# Altium project Wacky Racer.PrjPcb
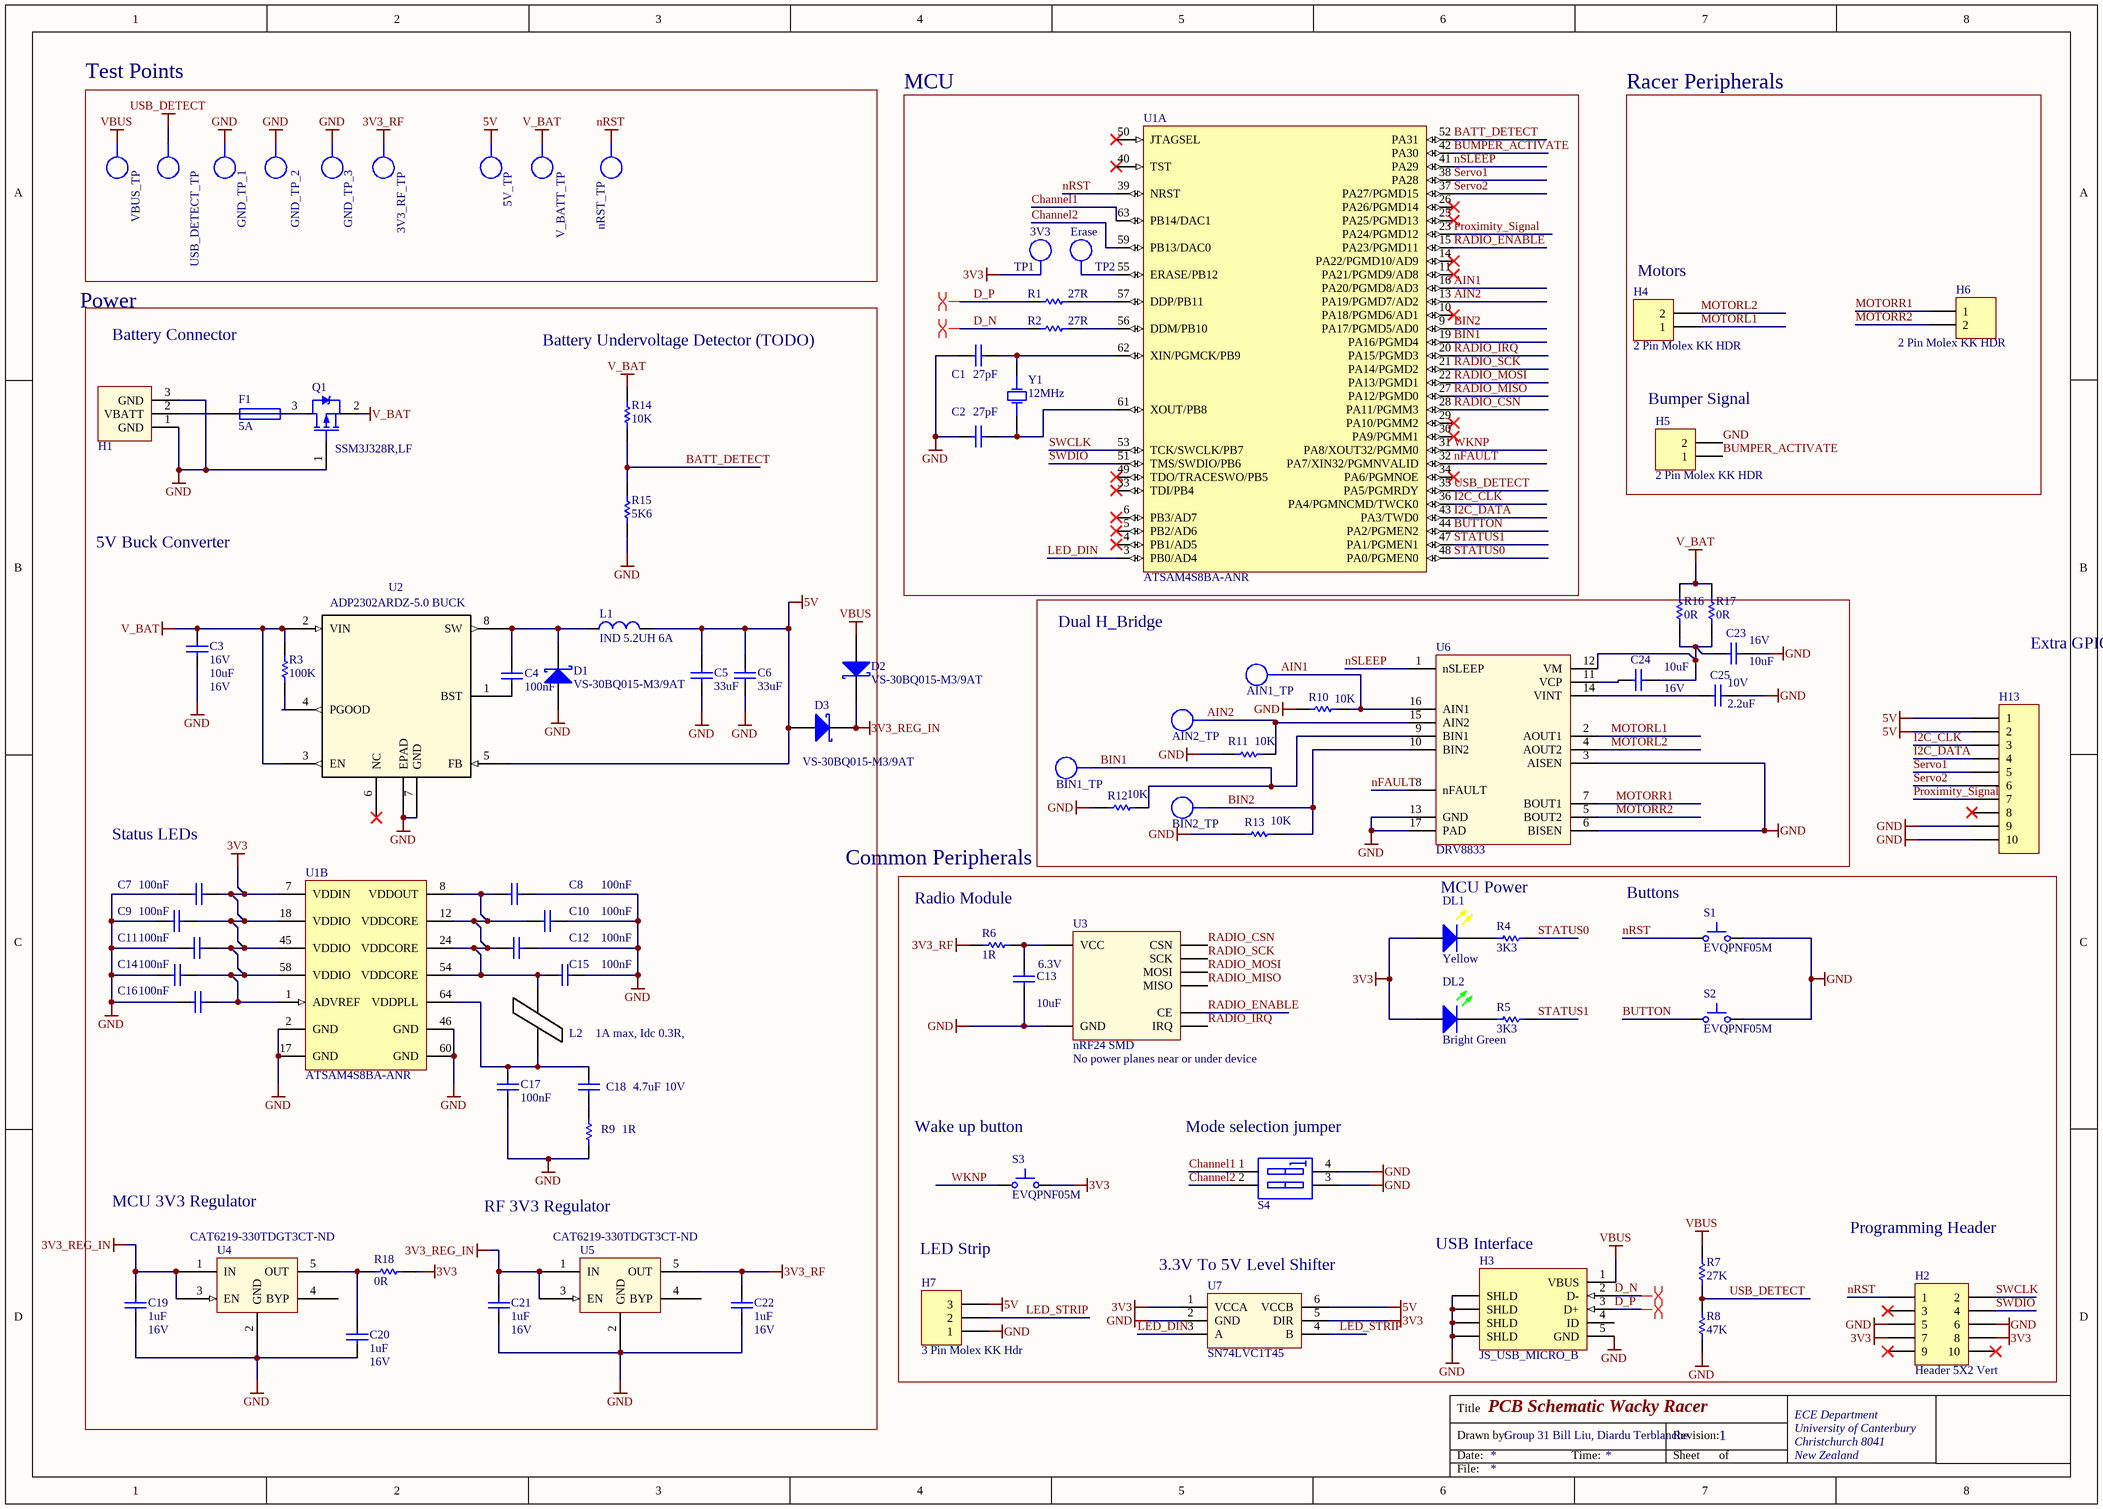
[diagram p0: Wacky Racer Schematic.schdoc]
1 sheet, 87 parts. Net scope: global (net labels, ports and power ports of the same name join across sheets).
Board files: Group31 B_L D_T.PcbDoc, Wacky_Racer_PCB.PcbDoc

## Sheet Wacky Racer Schematic.schdoc: PCB Schematic Wacky Racer
size A3; Author: Bill Liu, Diardu Terblanche; DrawnBy: Group 31 Bill Liu, Diardu Terblanche; Address1: ECE Department; Address2: University of Canterbury; Address3: Christchurch 8041; Address4: New Zealand; Revision: 1

### Parts
3V3_RF_TP  TP  [TP_1206]  (value not drawn)  (no BOM)
5V_TP  TP  [TP_1206]  (value not drawn)  (no BOM)
AIN1_TP  TP  [TP_1206]  (value not drawn)  (no BOM)
AIN2_TP  TP  [TP_1206]  (value not drawn)  (no BOM)
BIN1_TP  TP  [TP_1206]  (value not drawn)  (no BOM)
BIN2_TP  TP  [TP_1206]  (value not drawn)  (no BOM)
C1  27pF  [CAPC1608L]
C2  27pF  [CAPC1608L]
C3  Voltage - Rated: 16V  [CAPC2012L]  (hidden comment: 10uF)
C4  100nF  [CAPC1608L]
C5  33uF  [CAPC2012L]
C6  33uF  [CAPC2012L]
C7  100nF  [CAPC1608L]
C8  100nF  [CAPC1608L]
C9  100nF  [CAPC1608L]
C10  100nF  [CAPC1608L]
C11  100nF  [CAPC1608L]
C12  100nF  [CAPC1608L]
C13  Voltage - Rated: 6.3V  [CAPC1608L]  (hidden comment: 10uF)
C14  100nF  [CAPC1608L]
C15  100nF  [CAPC1608L]
C16  100nF  [CAPC1608L]
C17  100nF  [CAPC1608L]
C18  Max Voltage: 10V  [CAPC1608N]  (hidden comment: 4.7uF)
C19  Max Voltage: 16V  [CAPC1608L]  (hidden comment: 1uF)
C20  Max Voltage: 16V  [CAPC1608L]  (hidden comment: 1uF)
C21  Max Voltage: 16V  [CAPC1608L]  (hidden comment: 1uF)
C22  Max Voltage: 16V  [CAPC1608L]  (hidden comment: 1uF)
C23  Voltage - Rated: 16V  [CAPC2012L]  (hidden comment: 10uF)
C24  Voltage - Rated: 16V  [CAPC2012L]  (hidden comment: 10uF)
C25  Max Voltage: 10V  [CAPC1608L]  (hidden comment: 2.2uF)
D1  VS-30BQ015-M3/9AT  [SMC]
D2  VS-30BQ015-M3/9AT  [SMC]
D3  VS-30BQ015-M3/9AT  [SMC]
DL1  Yellow  [WL-SMCW0603]
DL2  Bright Green  [WL-SMCW0603]
F1  5A  [RESC3216N]
GND_TP_1  TP  [TP_1206]  (value not drawn)  (no BOM)
GND_TP_2  TP  [TP_1206]  (value not drawn)  (no BOM)
GND_TP_3  TP  [TP_1206]  (value not drawn)  (no BOM)
H1  Battery_HEADER_3pin  [BATT_HEADER_3POS]  (value not drawn)
H2  Header 5X2 Vert  [IDC2.54-V10D]
H3  JS_USB_MICRO_B  [FCI_USB_10118194-0001LF]
H4  2 Pin Molex KK HDR  [MOLEX_KK_2_HDR]
H5  2 Pin Molex KK HDR  [MOLEX_KK_2_HDR]
H6  2 Pin Molex KK HDR  [MOLEX_KK_2_HDR]
H7  3 Pin Molex KK Hdr  [MOLEX_KK_3_HDR]
H13  (no value)  [MOLEX_KK_10_HDR]
L1  IND 5.2UH 6A  [INDUCTOR5u2]
L2  1A max, Idc 0.3R,  [INDC3216L]
nRST_TP  TP  [TP_1206]  (value not drawn)  (no BOM)
Q1  SSM3J328R,LF  [SOT23_L]
R1  27R  [RESC1608L]
R2  27R  [RESC1608L]
R3  100K  [RESC1608L]
R4  3K3  [RESC1608L]
R5  3K3  [RESC1608L]
R6  1R  [RESC3216L]
R7  27K  [RESC1608L]
R8  47K  [RESC1608N]
R9  1R  [RESC3216L]
R10  10K  [RESC1608L]
R11  10K  [RESC1608L]
R12  10K  [RESC1608L]
R13  10K  [RESC1608L]
R14  10K  [RESC1608L]
R15  5K6  [RESC1608L]
R16  0R  [RESC1608L]
R17  0R  [RESC1608L]
R18  0R  [RESC1608L]
S1  EVQPNF05M  [EVQPNF05M]
S2  EVQPNF05M  [EVQPNF05M]
S3  EVQPNF05M  [EVQPNF05M]
S4  WS_SW DIP-2  [DIP_SW_2WAY_SMD]  (value not drawn)
TP1  3V3  [TP_1206]  (no BOM)
TP2  Erase  [TP_1206]  (no BOM)
U1  ATSAM4S8BA-ANR  [LQFP64_L]  (parts A,B of 2)
U2  ADP2302ARDZ-5.0 BUCK  [RD_8_1]
U3  nRF24 SMD  Warning: No power planes near or under device  [NRF24]
U4  Supplier Part Number: CAT6219-330TDGT3CT-ND  [SOT95P280X145-5N]  (hidden comment: CAT6219-330TDGT3)
U5  Supplier Part Number: CAT6219-330TDGT3CT-ND  [SOT95P280X145-5N]  (hidden comment: CAT6219-330TDGT3)
U6  DRV8833  [HTSOP16]
U7  SN74LVC1T45  [SOT23-6_N]
USB_DETECT_TP  TP  [TP_1206]  (value not drawn)  (no BOM)
V_BATT_TP  TP  [TP_1206]  (value not drawn)  (no BOM)
VBUS_TP  TP  [TP_1206]  (value not drawn)  (no BOM)
Y1  12MHz  [6.0X3.5-4]

### Blocks framed on the sheet
Test Points: 3V3_RF_TP 5V_TP GND_TP_1-GND_TP_3 nRST_TP USB_DETECT_TP V_BATT_TP VBUS_TP
MCU: C1 C2 R1 R2 TP1 TP2 U1 Y1
Racer Peripherals: H4-H6
Common Peripherals: C3-C12 C14-C22 D1-D3 F1 H1 L1 L2 Q1 R3 R9 R14 R15 R18 U1 U2 U4 U5
Dual H_Bridge: AIN1_TP AIN2_TP BIN1_TP BIN2_TP C23-C25 R10-R13 R16 R17 U6

### Nets
3V3: C7.2 C9.2 C11.2 C14.2 C16.2 DL1.2(A) DL2.2(A) H2.7 H2.8 R18.2 S3.2 TP1.1 U1.1(ADVREF) U1.7(VDDIN) U1.18(VDDIO) U1.45(VDDIO) U1.58(VDDIO) U7.1(VCCA) U7.5(DIR)
3V3_REG_IN: C19.2 C21.2 D2.2(K) D3.2(K) U4.1(IN) U4.3(EN) U5.1(IN) U5.3(EN)
3V3_RF: 3V3_RF_TP.1 C22.2 R6.1 U5.5(OUT)
5V: 5V_TP.1 C5.2 C6.2 D3.1(A) H7.3 H13.1 H13.2 L1.2 U2.5(FB) U7.6(VCCB)
GND: C1.1 C2.1 C3.1 C5.1 C6.1 C7.1 C8.2 C9.1 C10.2 C11.1 C12.2 C13.1 C14.1 C15.2 C16.1 C17.1 C19.1 C20.1 C21.1 C22.1 C23.2 C25.2 D1.1(A) GND_TP_1.1 GND_TP_2.1 GND_TP_3.1 H1.1(GND) H1.3(GND) H2.5 H2.6 H3.5(GND) H3.6(SHLD) H5.2 H7.1 H13.9 H13.10 Q1.1 R8.1 R9.1 R10.1 R11.1 R12.1 R13.1 R15.1 S1.2 S2.2 S4.3(B2) S4.4(B1) U1.2(GND) U1.17(GND) U1.46(GND) U1.60(GND) U2.7(GND) U2.EPAD U3.2(GND) U4.2(GND) U5.2(GND) U6.3(AISEN) U6.6(BISEN) U6.13(GND) U6.17(PAD) U7.2(GND)
nRST: H2.1 nRST_TP.1 S1.1 U1.39(NRST)
USB_DETECT: R7.1 R8.2 U1.35(PA5/PGMRDY) USB_DETECT_TP.1
V_BAT: C3.2 Q1.2 R3.2 R14.2 R16.2 R17.2 U2.2(VIN) U2.3(EN) V_BATT_TP.1
VBUS: D2.1(A) H3.1(VBUS) R7.2 VBUS_TP.1
AIN1: AIN1_TP.1 R10.2 U1.16(PA20/PGMD8/AD3) U6.16(AIN1)
AIN2: AIN2_TP.1 R11.2 U1.13(PA19/PGMD7/AD2) U6.15(AIN2)
BATT_DETECT: R14.1 R15.2 U1.52(PA31)
BIN1: BIN1_TP.1 R12.2 U1.19(PA16/PGMD4) U6.9(BIN1)
BIN2: BIN2_TP.1 R13.2 U1.9(PA17/PGMD5/AD0) U6.10(BIN2)
BUMPER_ACTIVATE: H5.1 U1.42(PA30)
BUTTON: S2.1 U1.44(PA2/PGMEN2)
Channel1: S4.1(A1) U1.63(PB14/DAC1)
Channel2: S4.2(A2) U1.59(PB13/DAC0)
D_N: H3.2(D-) R2.1
D_P: H3.3(D+) R1.1
I2C_CLK: H13.3 U1.36(PA4/PGMNCMD/TWCK0)
I2C_DATA: H13.4 U1.43(PA3/TWD0)
LED_DIN: U1.3(PB0/AD4) U7.3(A)
LED_STRIP: H7.2 U7.4(B)
MOTORL1: H4.1 U6.2(AOUT1)
MOTORL2: H4.2 U6.4(AOUT2)
MOTORR1: H6.1 U6.7(BOUT1)
MOTORR2: H6.2 U6.5(BOUT2)
nFAULT: U1.32(PA7/XIN32/PGMNVALID) U6.8(nFAULT)
nSLEEP: U1.41(PA29) U6.1(nSLEEP)
Proximity_Signal: H13.7 U1.23(PA24/PGMD12)
RADIO_CSN: U1.28(PA11/PGMM3) U3.4(CSN)
RADIO_ENABLE: U1.15(PA23/PGMD11) U3.3(CE)
RADIO_IRQ: U1.20(PA15/PGMD3) U3.8(IRQ)
RADIO_MISO: U1.27(PA12/PGMD0) U3.7(MISO)
RADIO_MOSI: U1.22(PA13/PGMD1) U3.6(MOSI)
RADIO_SCK: U1.21(PA14/PGMD2) U3.5(SCK)
Servo1: H13.5 U1.38(PA28)
Servo2: H13.6 U1.37(PA27/PGMD15)
STATUS0: R4.2 U1.48(PA0/PGMEN0)
STATUS1: R5.2 U1.47(PA1/PGMEN1)
SWCLK: H2.2 U1.53(TCK/SWCLK/PB7)
SWDIO: H2.4 U1.51(TMS/SWDIO/PB6)
WKNP: S3.1 U1.31(PA8/XOUT32/PGMM0)
NetC1_2: C1.2 U1.62(XIN/PGMCK/PB9) Y1.1(OSC1)
NetC2_2: C2.2 U1.61(XOUT/PB8) Y1.3(OSC2)
NetC4_1: C4.1 U2.1(BST)
NetC4_2: C4.2 D1.2(K) L1.1 U2.8(SW)
NetC8_1: C8.1 C10.1 C12.1 C15.1 L2.2 U1.8(VDDOUT) U1.12(VDDCORE) U1.24(VDDCORE) U1.54(VDDCORE)
NetC13_2: C13.2 R6.2 U3.1(VCC)
NetC17_2: C17.2 C18.2 L2.1 U1.64(VDDPLL)
NetC18_1: C18.1 R9.2
NetC20_2: C20.2 R18.1 U4.5(OUT)
NetC23_1: C23.1 C24.1 R16.1 R17.1 U6.12(VM)
NetC24_2: C24.2 U6.11(VCP)
NetC25_1: C25.1 U6.14(VINT)
NetDL1_1: DL1.1(K) R4.1
NetDL2_1: DL2.1(K) R5.1
NetF1_1: F1.1 H1.2(VBATT)
NetF1_2: F1.2 Q1.3
NetR1_2: R1.2 U1.57(DDP/PB11)
NetR2_2: R2.2 U1.56(DDM/PB10)
NetR3_1: R3.1 U2.4(PGOOD)
NetTP2_1: TP2.1 U1.55(ERASE/PB12)

Not connected (* = marked no-connect by the designer): H2 3* 9* 10*; H3 4(ID); H13 8*; U1 4(PB1/AD5)* 5(PB2/AD6)* 6(PB3/AD7)* 10(PA18/PGMD6/AD1)* 11(PA21/PGMD9/AD8)* 14(PA22/PGMD10/AD9)* 25(PA25/PGMD13)* 26(PA26/PGMD14)* 29(PA10/PGMM2)* 30(PA9/PGMM1)* 33(TDI/PB4)* 34(PA6/PGMNOE)* 40(TST)* 49(TDO/TRACESWO/PB5)* 50(JTAGSEL)*; U2 6(NC)*; U4 4(BYP); U5 4(BYP)

### Layout directives
differential pair: D_N, D_P

### Notes on the sheet
- Power
- (near H4) Motors
- Battery Connector
- (near R14) Battery Undervoltage Detector (TODO)
- (near H5) Bumper Signal
- 5V Buck Converter
- Extra GPIO headers
- Status LEDs
- (near R6) Radio Module
- MCU Power
- (near S1) Buttons
- (near S3) Wake up button
- (near S4) Mode selection jumper
- MCU 3V3 Regulator
- RF 3V3 Regulator
- LED Strip
- (near H3) USB Interface
- Programming Header
- (near U7) 3.3V To 5V Level Shifter
- Title
- Drawn by:
- Date:
- Time:
- Revision:
- Sheet
- of
- File:

### Library data of the parts
3V3_RF_TP 5V_TP AIN1_TP AIN2_TP BIN1_TP BIN2_TP GND_TP_1-GND_TP_3 nRST_TP USB_DETECT_TP V_BATT_TP VBUS_TP = TP_1206: Test-Point 3.3x1.6x2.1mm SMD; Manufacturer: Harwin Inc; Manufacturer Part Number: S1751-46R; Manufacturer PN: *; Storage Location: ProtoPlace; Mounting Type: Surface Mount; Type: PC Test Point; Supplier 1: Digi-Key; Supplier Part Number 1: 952-1478-2-ND; Supplier 2: Farnell; Supplier Part Number 2: 1826282; Supplier: ECE Dept; Value: TP
C1 C2 = CC_27pF_0603: CAP CER 27pF NPO/COG +-5% 50V 0603; PackageReference: 0603; Code_IPC: 1608 [0603]; Verify: *; Supplier: ECE Dept; Storage Location: PCB Assembly WS; Value: 27pF
C3 C23 C24 = CC_10uF_16V_0805: CAP CER 10uF X5R 16V 0805; Manufacturer: Samsung Electro-Mechanics; Manufacturer Part Number: CL21A106KOQNNWE; Note: Footprint corresponds to dimensions for bulk cassette packaging. This case size has tightened tolerances.; Tolerance: ±10%; Notification: Current market demand for these product types have resulted in fluctuating and extending lead times. Lead times may differ.; PackageReference: 0805; Code_IPC: 2012[0805]; Supplier 1: Digi-Key; RoHS: RoHS Compliant; Category: Capacitors; Stock 1: 20000; Pricing 1: 1=0.35, 10=0.25, 100=0.1178, 500=0.08254, 1000=0.06831 (NZD); Packaging: Cut Tape (CT); Part Status: Active; Temperature Coefficient: X5R; Operating Temperature: -55°C ~ 85°C; Features: -; Ratings: -; Applications: General Purpose; Mounting Type: Surface Mount, MLCC; Package / Case: 0805 (2012 Metric); Size / Dimension: 0.079" L x 0.049" W (2.00mm x 1.25mm); Height - Seated (Max): -; Thickness (Max): 0.055" (1.40mm); Lead Spacing: -; Lead Style: -; ComponentLink1URL: http://www.samsungsem.com/kr/support/product-search/mlcc/CL21A106KOQNNWE.jsp; ComponentLink1Description: http://www.samsungsem.com/kr/support/product-search/mlcc/CL21A106KOQNNWE.jsp; Supplier Part Number 1: 1276-2894-1-ND; Value: 10uF
  C3: Max Voltage: 16V
C4 C7-C12 C14-C17 = CC_100nF_0603: CAP CER 100nF X7R +-10% 50V 0603; PackageReference: 0603; Code_IPC: 1608 [0603]; Verify: *; Supplier: ECE Dept; Storage Location: PCB Assembly WS; Value: 100nF
C5 C6 = CC_33uF_6V3_0805: CAP CER 33uF X5R 6V3 0805; Manufacturer: TDK Corporation; Manufacturer Part Number: C2012X5R0J336M125AC; Tolerance: ±20%; Voltage - Rated: 6.3V; Notification: Current market demand for these product types have resulted in fluctuating and extending lead times. Lead times may differ.; Supplier 1: Digi-Key; RoHS: RoHS Compliant; Category: Capacitors; Stock 1: 20000; Pricing 1: 1=1.65, 10=1.262, 100=0.9023, 500=0.6985, 1000=0.60149 (NZD); Packaging: Cut Tape (CT); Part Status: Active; Temperature Coefficient: X5R; Operating Temperature: -55°C ~ 85°C; Features: Low ESL; Ratings: -; Applications: General Purpose; Failure Rate: -; Mounting Type: Surface Mount, MLCC; Package / Case: 0805 (2012 Metric); Size / Dimension: 0.079" L x 0.049" W (2.00mm x 1.25mm); Height - Seated (Max): -; Thickness (Max): 0.057" (1.45mm); Lead Spacing: -; Lead Style: -; ComponentLink1URL: https://product.tdk.com/info/en/catalog/datasheets/mlcc_commercial_general_en.pdf; ComponentLink1Description: https://product.tdk.com/info/en/catalog/datasheets/mlcc_commercial_general_en.pdf; Supplier Part Number 1: 445-5986-1-ND; Value: 33uF
C13 = CC_10uF_0603: CAP CER 10UF X5R +-20% 6V3 0603; Supplier: ECE Dept; Storage Location: PCB Assembly WS; Value: 10uF
C18 = CC_4.7uF_0603: CAP CER 4.7uF X5R +-20%  10V 0603; Note: Footprint corresponds to dimensions for bulk cassette packaging. This case size has tightened tolerances.; PackageReference: 0805; Code_IPC: 2012[0805]; Verify: *; Supplier: ECE Dept; Storage Location: PCB Assembly WS; Value: 4.7uF
C19-C22 = CC_1uF_0603: CAP CER 1uF Y5V -20% +80% 16V 0603; PackageReference: 0603; Code_IPC: 1608 [0603]; Verify: *; Supplier: ECE Dept; Storage Location: PCB Assembly WS; Value: 1uF
C25 = CC_2.2uF_0603: CAP CER 2.2uF X5R +-20% 10V 0603; PackageReference: 0603; Code_IPC: 1608 [0603]; Verify: *; Supplier: ECE Dept; Storage Location: PCB Assembly WS; Value: 2.2uF
D1-D3 = DS_VS-30BQ015-M3: DIODE, SCHOTTKY, 3A, 15V, DO-214AB / SMC; Manufacturer: Vishay Semiconductors; Forward Voltage: 350mV; Max Forward Surge Current (Ifsm): 650A; Peak Reverse Current: 4mA; Average Rectified Current: 3A; Max Reverse Voltage (DC): 15V; Supplier: Digi-Key; ComponentLink1URL: https://datasheet.ciiva.com/36181/vs-30bq015-m3-9at-36181258.pdf; ComponentLink1Description: https://datasheet.ciiva.com/36181/vs-30bq015-m3-9at-36181258.pdf; Supplier 1: Digi-Key; Supplier 2: Element14; Supplier Part Number 1: VS-30BQ015-M3/9ATGIDKR-ND; Supplier Part Number 2: 2628288; Supplier Part Number: VS-30BQ015-M3/9AT-ND; Manufacturer Part Number: VS-30BQ015-M3/9AT
DL1 = DL_150060YS75000: LED Yellow 120mcd 0603 SMD; Manufacturer: WURTH ELEKTRONIK; Forward Current If: 30; Forward Voltage: 2; Wavelength Typ: 590; Lens Shape: Rectangular; Viewing Angle: 140°; Luminous Intensity: 120; LED Mounting: SMD; Supplier 1: Farnell; Supplier Part Number 1: 2322074; Manufacturer Part Number: 150060YS75000; Storage Location: PCB Assembly WS; Supplier: ECE Dept; LED Colour: Yellow
DL2 = DL_150060VS75000: LED Bright Green 40mcd 0603 SMD; Manufacturer: WURTH ELEKTRONIK; Forward Current If: 30; Forward Voltage: 2; Viewing Angle: 140°; Wavelength Typ: 570; Luminous Intensity: 40; LED Mounting: SMD; Supplier 1: Farnell; Supplier Part Number 1: 2322073; Manufacturer Part Number: 150060VS75000; Storage Location: PCB Assembly WS; Supplier: ECE Dept; LED Colour: Bright Green
F1 = FS_Fuse_5.0A: Fuse 5.0A Fast Acting 1206 SMD; Manufacturer Part Number: C1F5; Manufacturer: Bel TRP; Voltage Rating (AC): 125V; Voltage Rating (DC): 63V; DC Cold Resistance: 19mR; Fuse Type: Board Mount (Cartridge Style Excluded); Approvals: CE,cURus; Mount: Surface Mount; Case/Package: 1206; Number of Pins: 2; Case Code (Metric): 3216; Case Code (Imperial): 1206; Contact Plating: Nickel,Tin; Min Operating Temperature: -55°C; Max Operating Temperature: 125°C; Packaging: Tape and Reel; Voltage Rating: 125V; Length: 0.126inch; Width: 0.062inch; Supplier 1: Digi-Key; Stock 1: 725; Pricing 1: 1=0.32, 5=0.312, 10=0.298, 50=0.2662, 100=0.2479, 250=0.22032, 500=0.1836, 1000=0.17442 (USD); ComponentLink1URL: http://www.farnell.com/datasheets/2571625.pdf; ComponentLink1Description: http://www.farnell.com/datasheets/2571625.pdf; ComponentLink2URL: http://belfuse.com/pdfs/C1F.pdf; ComponentLink2Description: http://belfuse.com/pdfs/C1F.pdf; ComponentLink3URL: http://www.mouser.com/ds/2/643/C1F-594910.pdf; ComponentLink3Description: http://www.mouser.com/ds/2/643/C1F-594910.pdf; ComponentLink4URL: https://belfuse.com/resources/StewartConnector/C1F.pdf; ComponentLink4Description: https://belfuse.com/resources/StewartConnector/C1F.pdf; Current Rating: 5A; Supplier Part Number 1: 507-1886-1-ND; Supplier 2: Element14; Supplier Part Number 2: 2848595; Value: 5A
H1 = Battery_HEADER_3pin: 3Pin Header 2.54mm spacing
H2 = JA_HDR_IDC_5X2_VERT: IDC Header, 2,54mm, 10-Pin, Vert; Supplier: ECE Dept; Supplier 1: Farnell; Supplier Part Number 1: 1096985; Storage Location: ECE Dept Store
H3 = JS_USB_MICRO_B_SMT: CONN USB MICRO B RECPT SMT R/A; Manufacturer: FCI; Manufacturer Part Number: 10118194-0001LF; Gender: Receptacle; Number of Contacts: 5; Specifications: USB 2.0; Supplier 1: Digi-Key; Supplier Part Number 1: 609-4618-1-ND; Features: Shielded, Solder Retention; Mounting Type: Surface Mount, Right Angle, Horizontal
H4-H6 = JA_MOLEX_KK_2POS: CONN HEADER 2POS 2.54mm VERT_Thru Hole; Supplier 1: Farnell; Supplier Part Number 1: 1462926; Supplier: ECE Dept; Storage Location: ECE Dept Store; Value: 2 Pin Molex KK HDR
H7 = JA_MOLEX_KK_3POS: CONN HEADER 3POS 2.54mm VERT_Thru Hole; Manufacturer: Molex; Manufacturer PN: 22-23-2031; Supplier Part Number 1: 9731156; Supplier: ECE Dept; Supplier 1: Farnell; Storage Location: ECE Dept Store; Value: 3 Pin Molex KK Hdr
H13 = JA_MOLEX_KK_10POS: CONN HEADER 10POS 2.54mm VERT_ Thru Hole; Supplier 1: Farnell; Supplier Part Number 1: 1756828; Supplier: ECE Dept; Storage Location: ECE Dept Store
L1 = CDRH104RNP-5R2NC: FIXED IND 5.2UH 6A 22 MOHM SMD; Manufacturer: Sumida America Components Inc.; Material - Core: Ferrite; Tolerance: ±30%; Current - Saturation: 5.6A; Shielding: Shielded; DC Resistance (DCR): 22 mOhm Max; Supplier 1: Digi-Key; Manufacturer Part Number: CDRH104RNP-5R2NC; RoHS: RoHS Compliant; Category: Inductors, Coils, Chokes; Stock 1: 3849; Pricing 1: 1=2.9, 10=2.678, 100=1.8743, 500=1.5173 (NZD); Packaging: Cut Tape (CT); Part Status: Active; Type: -; Q @ Freq: -; Frequency - Self Resonant: -; Ratings: -; Operating Temperature: -40°C ~ 100°C; Mounting Type: Surface Mount; Package / Case: Nonstandard; Supplier Device Package: -; Size / Dimension: 0.402" L x 0.394" W (10.20mm x 10.00mm); Height - Seated (Max): 0.157" (4.00mm); ComponentLink1URL: http://products.sumida.com/products/pdf/CDRH104R.pdf; ComponentLink1Description: http://products.sumida.com/products/pdf/CDRH104R.pdf; Supplier Part Number 1: 308-2280-1-ND
L2 = IN_Ferrite-Bead: Ferrite Bead, Rdc 0.3R, Z100MHZ 600R, Imax 1A, SMD 1206; Manufacturer: FAIR-RITE; Manufacturer PN: 2512066017Y1; DC Current Rating: 1; DC Resistance Max: 0.08; Ferrite Case Style: 1206 ^3216 Metric]; Frequency Range: 50MHz to 1; Impedance: 600; Impedance Tolerance: ± 25%; Supplier: ECE Dept; Storage Location: PCB Assembly WS; Ferrite Mounting: SMD; Supplier 1: Farnell; Supplier Part Number 1: 1612060; Manufacturer Part Number: 2512066017Y1; Value: 1A max, Idc 0.3R,
Q1 = TM_SSM3J328R: MOSFET P-CH 20V 6A SOT23-3; Manufacturer: Toshiba; FET Feature: Logic Level Gate, 1.5V Drive; FET Type: MOSFET P-Channel, Metal Oxide; Gate Charge (Qg) @ Vgs: 12.8nC @ 4.5V; Input Capacitance (Ciss) @ Vds: 840pF @ 10V; Power - Max: 1W; Rds On Max: 29.8mR; Drain to Source Resistance: 47.4mR; Turn-On Delay Time: 32ns; Power Dissipation: 2W; Number of Channels: 1; Turn-Off Delay Time: 107ns; Gate to Source Voltage (Vgs): 8V; Input Capacitance: 840pF; Element Configuration: Single; Drain to Source Breakdown Voltage: -20V; Vgs(th) (Max) @ Id: 1V @ 1mA; Current - Continuous Drain (Id) @ 25° C: 6A; Drain to Source Voltage (Vdss): 20V; Package / Case: SOT-23-3 Flat Leads; Supplier Device Package: SOT-23F; Pricing: 1=0.79, 10=0.658, 25=0.5772, 100=0.4939, 250=0.42836, 500=0.36284, 1000=0.27972 (NZD); Storage Location: PCB Assembly WS; Supplier: Digi-Key; ComponentLink1URL: https://datasheet.ciiva.com/11158/ssm3j328r-datasheet-en-20140301-11158652.pdf; ComponentLink1Description: https://datasheet.ciiva.com/11158/ssm3j328r-datasheet-en-20140301-11158652.pdf; Supplier Part Number: SSM3J328RLFDKR-ND; Max Operating Temperature: 150°C; Mount: Surface Mount; Packaging: Tape and Reel; Min Operating Temperature: -55°C; Continuous Drain Current (ID): 6A; Radiation Hardening: No; Max Power Dissipation: 1W; Package Quantity: 3000; Case/Package: SOT-23-3; Number of Pins: 3; Number of Elements: 1; Supplier 1: Digi-Key; Supplier Part Number 1: SSM3J328RLFDKR-ND; Manufacturer Part Number: SSM3J328R,LF
R1 R2 = RS_27R: RES 27 OHM 1/10W 5% 0603 SMD; Storage Location: PCB Assembly WS; Supplier: ECE Dept; Value: 27R
R3 = RS_100K: RES 100K OHM 1/10W 5% 0603 SMD; Storage Location: PCB Assembly WS; Supplier: ECE Dept; Value: 100K
R4 R5 = RS_3K3: RES 3.3K OHM 1/10W 5% 0603 SMD; Storage Location: PCB Assembly WS; Supplier: ECE Dept; Value: 3K3
R6 R9 = RT_1R: RES 1R OHM 1/4W 5% 1206 SMD; Storage Location: PCB Assembly WS; Supplier: ECE Dept; Value: 1R
R7 = RS_27K: RES 27K OHM 1/10W 5% 0603 SMD; Storage Location: PCB Assembly WS; Supplier: ECE Dept; Value: 27K
R8 = RS_47K: RES 47.0K OHM 1/10W 5% 0603 SMD; Storage Location: PCB Assembly WS; Supplier: ECE Dept; Value: 47K
R10-R14 = RS_10K: RES 10.0K OHM 1/10W 5% 0603 SMD; Storage Location: PCB Assembly WS; Supplier: ECE Dept; Value: 10K
R15 = RS_5K6: RES 5.6K OHM 1/10W 5% 0603 SMD; Storage Location: PCB Assembly WS; Supplier: ECE Dept; Value: 5K6
R16-R18 = RS_0R0: RES 0.0 OHM 1/10W 5% 0603 SMD; Storage Location: PCB Assembly WS; Supplier: ECE Dept; Value: 0R
S1-S3 = WS_EVQPNF05M: Panasonic 6 x 3.5mm SMD Light Touch Switch Type SMD; PackageDescription: 6.0 x 3.5 mm; Supplier 1: Farnell; Supplier Part Number 1: 2079481; Manufacturer: Panasonic; Manufacturer PN: EVQPNF05M; Supplier 2: Digi-Key; Supplier Part Number 2: P13598SCT-ND; Storage Location: PCB Assembly WS; Supplier: ECE Dept
S4 = WS_SW DIP-2: DIP Switch, 2 Position, SPST SMD; Manufacturer: OMRON ELECTRONIC COMPONENTS; Manufacturer Part Number: A6SN-2101; Contact Current DC Max: 25; External Length / Height: 7; No. of Switch Positions: 2; Pitch Spacing: 2.54; PackageReference: DIP-4; Contact Configuration: SPST; Supplier 1: Farnell; Supplier Part Number 1: 2029424; Storage Location: PCB Assembly WS; Supplier: ECE Dept
TP1 TP2 = TP_1206: Test-Point 3.3x1.6x2.1mm SMD; Manufacturer: Harwin Inc; Manufacturer Part Number: S1751-46R; Value: TP; Manufacturer PN: *; Storage Location: ProtoPlace; Mounting Type: Surface Mount; Type: PC Test Point; Supplier 1: Digi-Key; Supplier Part Number 1: 952-1478-2-ND; Supplier 2: Farnell; Supplier Part Number 2: 1826282; Supplier: ECE Dept
U1 = SE_ATSAM4S16BA-MU: IC MCU 32BIT 512KB FLASH 64LQFP; Manufacturer: Atmel; Connectivity: I²C, IrDA, Memory Card, SPI, SSC, UART/USART, USB; Core Processor: ARM® Cortex®-M4; Core Size: 32-Bit; Data Converters: A/D 11x12b, D/A 2x12b; Number of I/O: 47; Peripherals: Brown-out Detect/Reset, DMA, POR, PWM, WDT; Program Memory Size: 512KB (512K x 8); RAM Size: 128K x 8; Speed: 120MHz; Voltage - Supply (Vcc/Vdd): 1.62 V ~ 3.6 V; PackageVersion: revJ, Jul-2007; PackageReference: 64PS; PackageDescription: 64-Pin Quad Flat No-Lead (QFN) Sawn, 9 x 9 x 1.0 mm Body, 0.5 mm Pitch, Exposed Pad; Code_JEDEC: MO-220VMMD-3; ComponentLink1Description: Manufacturer URL; ComponentLink1URL: http://www.atmel.com/; ComponentLink2Description: SAM4S Series Datasheet; ComponentLink2URL: http://www.atmel.com/dyn/resources/prod_documents/11100.pdf; ComponentLink3Description: SAM4S Series Summary; ComponentLink3URL: http://www.atmel.com/dyn/resources/prod_documents/11100S.pdf; Supplier 1: Digi-Key; Package / Case: 64-LQFP; Packaging: Cut Tape (CT); Program Memory Type: FLASH; Supplier Part Number 1: ATSAM4S8BA-ANRCT-ND; Manufacturer Part Number: ATSAM4S8BA-ANR
U2 = ADP2302ARDZ-5.0-R7: IC REG BUCK 5V 2A 8SOIC; Vendor: Analog Devices Inc; Frequency - Switching: 700kHz; Output Type: Fixed; Voltage - Input (Max): 20V; Manufacturer_Part_Number: ADP2302ARDZ-5.0-R7; Type: DEV; Value: Value; Supplier 1: Digi-Key; Current - Output: 2A; Voltage - Output (Min/Fixed): 5V; Supplier Part Number 1: ADP2302ARDZ-5.0-R7CT-ND
U3 = NRF24: nRF24 SMD Module
U4 U5 = SV_CAT6219-330TDGT3: IC REG LIN 3.3V 500MA TSOT23-5; Voltage - Input (Max): 5.5V; Voltage Dropout (Max): 0.5V @ 500mA; Manufacturer Part Number: CAT6219-330TDGT3; Base Part Number: CAT6219; Current - Output: 500mA; Package / Case: SOT-23-5 Thin, TSOT-23-5; Supplier: Digi-Key; Supplier Device Package: TSOT-23-5; Voltage - Output (Min/Fixed): 3.3V; ComponentLink1URL: http://www.onsemi.com/pub/Collateral/CAT6219-D.PDF; ComponentLink1Description: http://www.onsemi.com/pub/Collateral/CAT6219-D.PDF; Supplier 1: Digi-Key
U6 = DRV8833: Dual H-Bridge Motor Driver 1.5A
U7 = SN74LVC1T45: 1.8V - 5V level converter
Y1 = XT_CRYSTAL_12MHz_18pF: CRYSTAL 12MHZ 18PF 6X3.5mm SMD; Manufacturer: CTS-Frequency Controls; Manufacturer Part Number: 406C35D12M00000; ESR (Equivalent Series Resistance): 60 Ohm; Frequency Stability: ±50ppm; Frequency Tolerance: ±30ppm; Operating Mode: Fundamental; Supplier 1: Digi-Key; Height: 0.047" (1.20mm); Load Capacitance: 18pF; Mounting Type: Surface Mount; Operating Temperature: -20°C ~ 70°C; Package / Case: 4-SMD, No Lead (DFN, LCC); Size / Dimension: 0.236" L x 0.138" W (6.00mm x 3.50mm); Supplier Part Number 1: CTX855CT-ND; Frequency: 12MHz